# EasyEDA schematic SCH_LinBridge_3.0_2026-08-19_sanitized.json
TITLE: LinBridge; REV: 1.0; Date: 2024-12-13; Sheet: 1/1; Drawn By: LinBridge project; Company: LinBridge
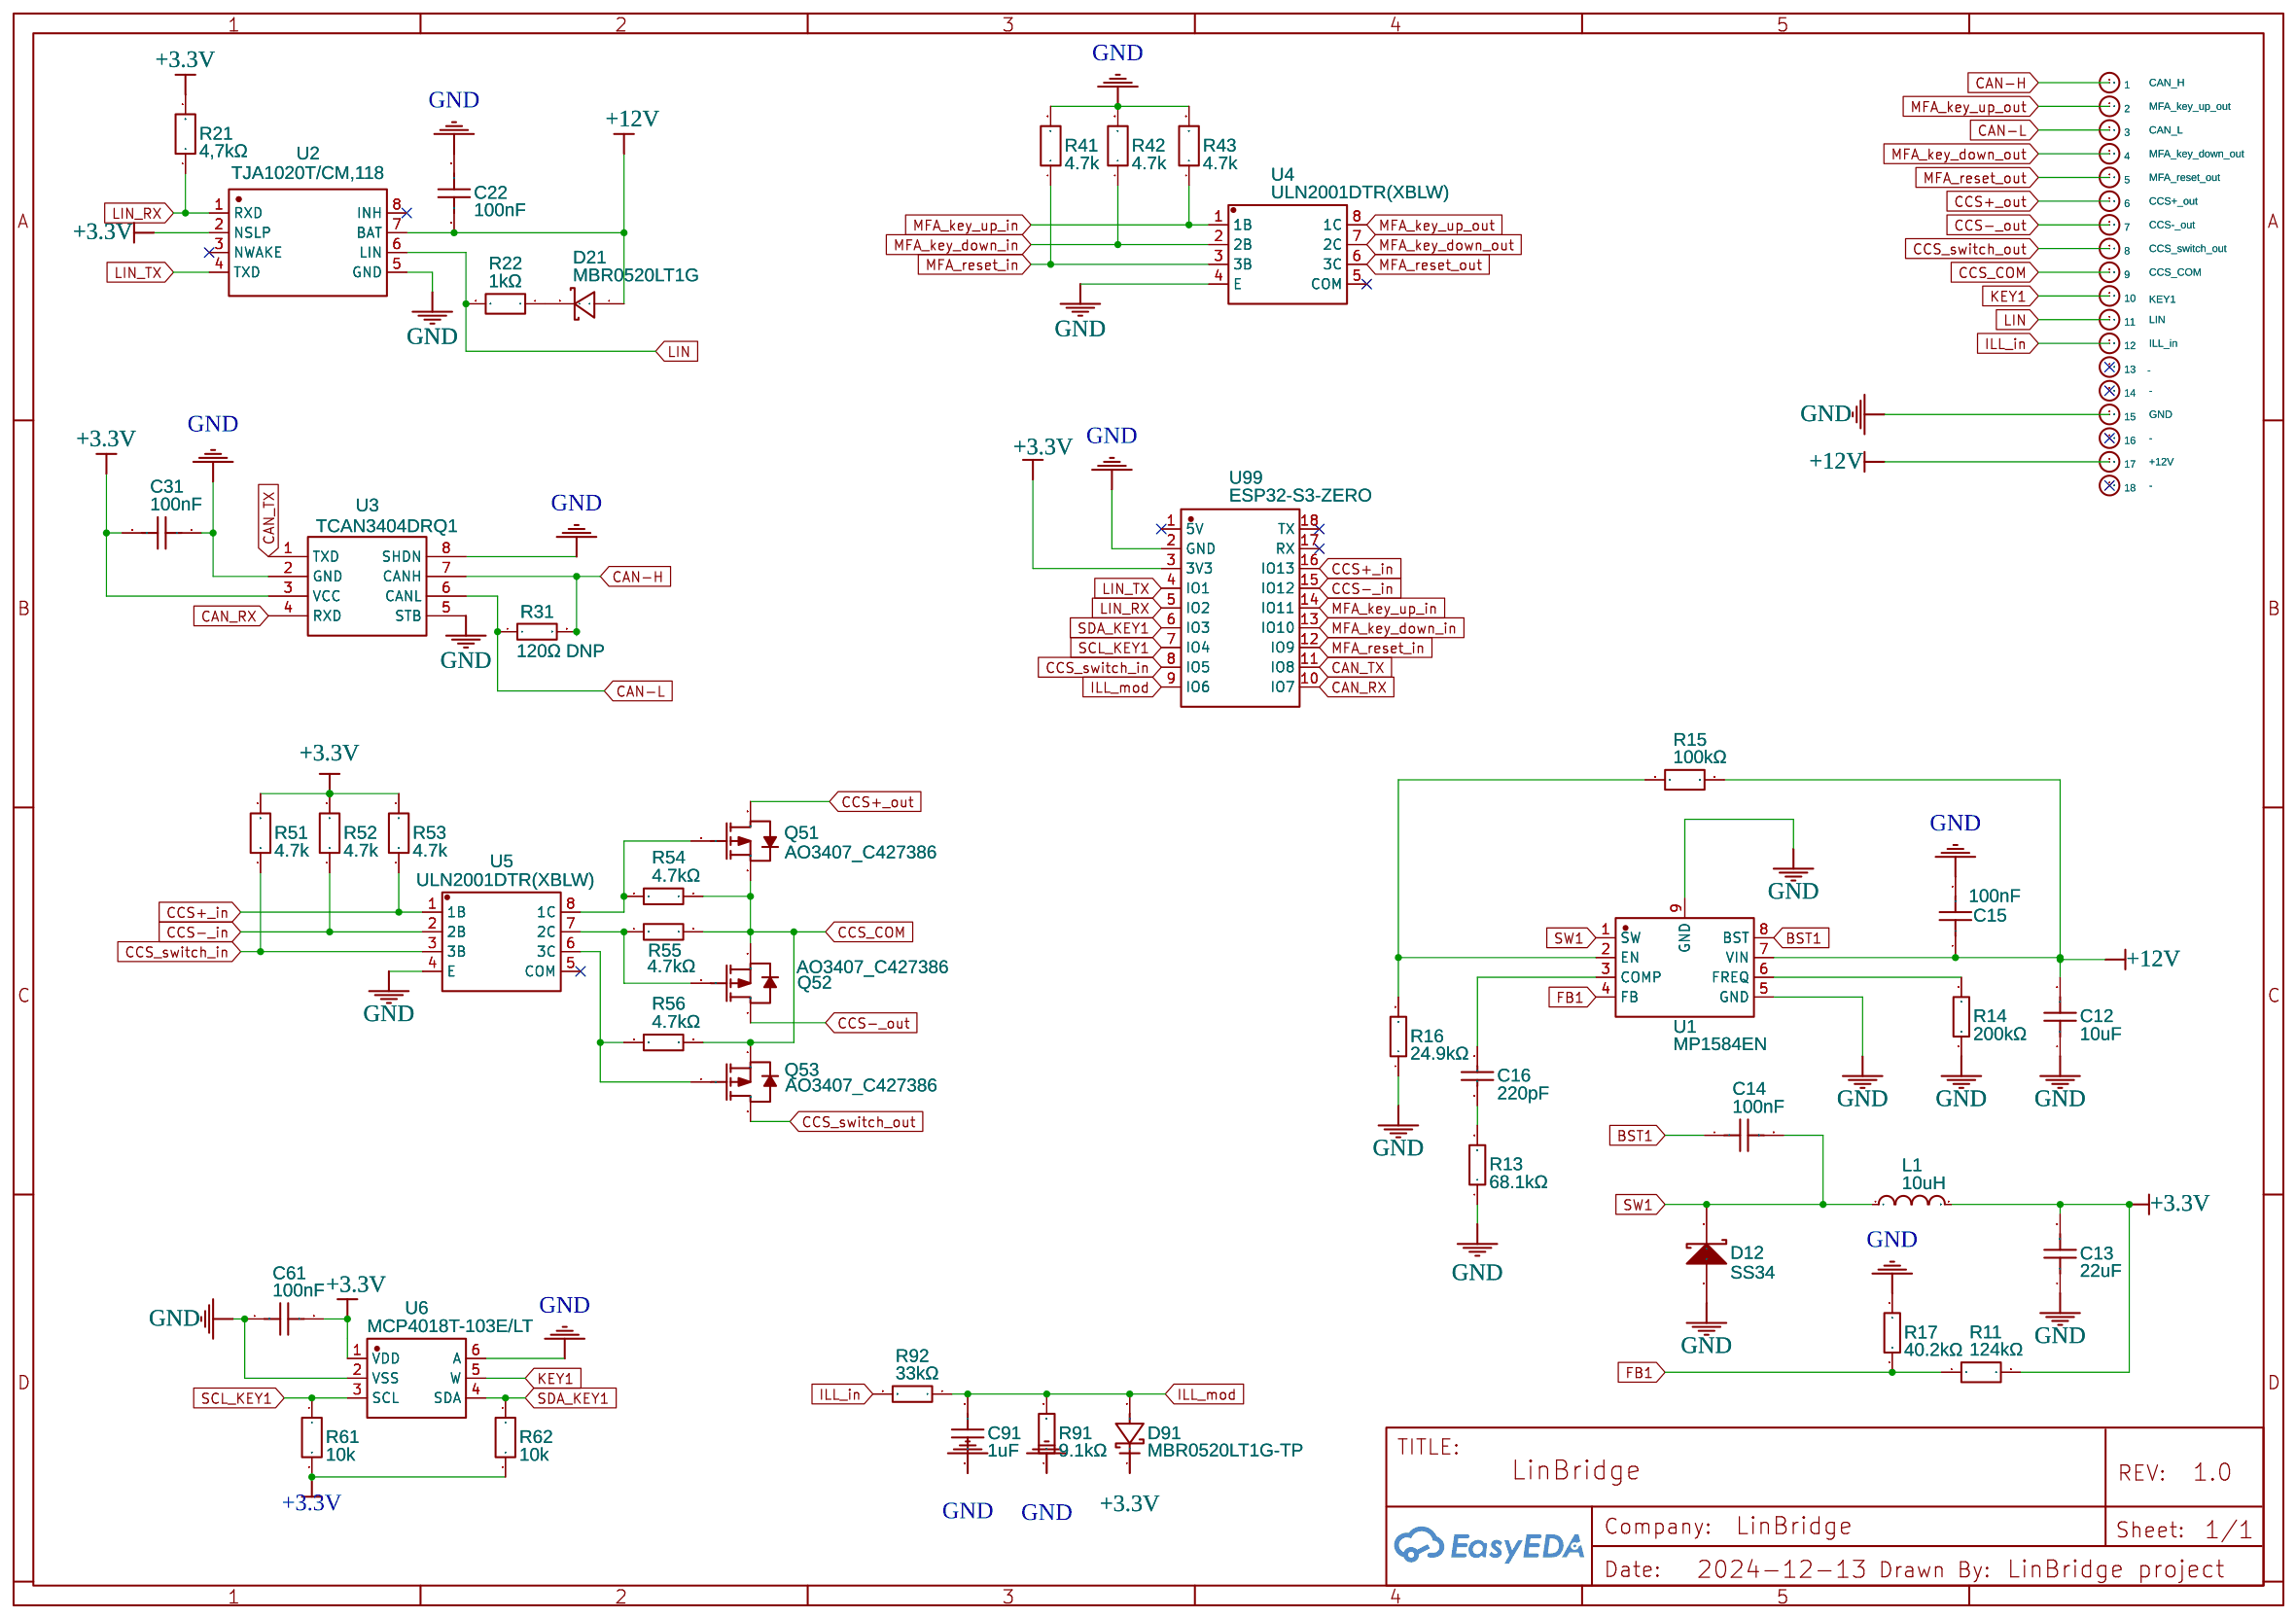
[diagram p0: schematic sheet]

## Parts
1  CAN_H  [THROUGH-HOLE-1MM]
2  MFA_key_up_out  [THROUGH-HOLE-1MM]
3  CAN_L  [THROUGH-HOLE-1MM]
4  MFA_key_down_out  [THROUGH-HOLE-1MM]
5  MFA_reset_out  [THROUGH-HOLE-1MM]
6  CCS+_out  [THROUGH-HOLE-1MM]
7  CCS-_out  [THROUGH-HOLE-1MM]
8  CCS_switch_out  [THROUGH-HOLE-1MM]
9  CCS_COM  [THROUGH-HOLE-1MM]
10  KEY1  [THROUGH-HOLE-1MM]
11  LIN  [THROUGH-HOLE-1MM]
12  ILL_in  [THROUGH-HOLE-1MM]
13  -  [THROUGH-HOLE-1MM]
14  -  [THROUGH-HOLE-1MM]
15  GND  [THROUGH-HOLE-1MM]
16  -  [THROUGH-HOLE-1MM]
17  +12V  [THROUGH-HOLE-1MM]
18  -  [THROUGH-HOLE-1MM]
C12  10uF  [C1206]
C13  22uF  [C0805]
C14  100nF  [C0805]
C15  100nF  [C0805]
C16  220pF  [C0805]
C22  100nF  [C0805]
C31  100nF  [C0805]
C61  100nF  [C0805]
C91  1uF  [C0805]
D12  SS34  [SMA(DO-214AC)]
D21  MBR0520LT1G  [MBR0520LT1G]
D91  MBR0520LT1G-TP  [SOD-123_L2.7-W1.6-LS3.6-RD]
L1  10uH  [IND-SMD_L4.0-W4.0_LQH44PN2R2MP0L]
Q51  AO3407_C427386  [SOT-23-3_L2.9-W1.3-P1.90-LS2.4-BR]
Q52  AO3407_C427386  [SOT-23-3_L2.9-W1.3-P1.90-LS2.4-BR]
Q53  AO3407_C427386  [SOT-23-3_L2.9-W1.3-P1.90-LS2.4-BR]
R11  124kΩ  [R0805]
R13  68.1kΩ  [R0805]
R14  200kΩ  [R0805]
R15  100kΩ  [R0805]
R16  24.9kΩ  [R0805]
R17  40.2kΩ  [R0805]
R21  4,7kΩ  [R0805]
R22  1kΩ  [R0805]
R31  120Ω DNP  [R0805]
R41  4.7k  [R0805]
R42  4.7k  [R0805]
R43  4.7k  [R0805]
R51  4.7k  [R0805]
R52  4.7k  [R0805]
R53  4.7k  [R0805]
R54  4.7kΩ  [R0805]
R55  4.7kΩ  [R0805]
R56  4.7kΩ  [R0805]
R61  10k  [R0805]
R62  10k  [R0805]
R91  9.1kΩ  [R0805]
R92  33kΩ  [R0805]
U1  MP1584EN  [SOIC-8_L4.9-W3.9-P1.27-LS6.0-BL-EP3.3]
U2  TJA1020T/CM,118  [SOIC-8_L4.9-W3.9-P1.27-LS6.0-BL]
U3  TCAN3404DRQ1  [SOIC-8_L5.0-W4.0-P1.27-LS6.0-BL]
U4  ULN2001DTR(XBLW)  [SOP-8_L5.0-W4.0-P1.27-LS6.0-BL]
U5  ULN2001DTR(XBLW)  [SOP-8_L5.0-W4.0-P1.27-LS6.0-BL]
U6  MCP4018T-103E/LT  [SC-70-6_L2.0-W1.3-P0.65-LS2.1-BL]
U99  ESP32-S3-ZERO  [COMM-SMD_18P-P2.54-L23.5-W18.0-TL]

## Library data of the parts
1-18 = Through_Hole_1mm: Supplier Part: undefined; Contributor: P-Thomsen
C12 = TCC1206X5R106K500HT: Supplier: LCSC; Contributor: lcsc; JLCPCB Part Class: Extended Part
C13 = TCC1206X7R226M100HT: Supplier: LCSC; JLCPCB Part Class: Extended Part; Contributor: lcsc
C14 = TCC0603X7R104K250CT: Supplier: LCSC; JLCPCB Part Class: Extended Part; Contributor: lcsc
C15 C22 = C0805C104K5RAC7411: Contributor: LCSC; Supplier: LCSC; Supplier Part: C141128; Manufacturer: KEMET(基美); JLCPCB Part Class: Extended Part
C16 = CC0603JRNPO9BN221: Supplier: LCSC; JLCPCB Part Class: Extended Part
C31 = C0805-100NF: Contributor: LCSC; Supplier: LCSC; Supplier Part: C502153; Manufacturer: IHHEC(禾伸堂); Manufacturer Part: C0805X104K050T; JLCPCB Part Class: Extended Part
C61 = CC0805KRX7R7BB104: Contributor: LCSC; Supplier: LCSC; Supplier Part: C519980; Manufacturer: YAGEO(国巨); JLCPCB Part Class: Extended Part
C91 = C0805C105K5RACTU: Supplier: LCSC; Supplier Part: C3018567; Manufacturer: KEMET(基美); Contributor: lcsc; JLCPCB Part Class: Extended Part
D12 = -: Supplier: LCSC; Manufacturer: ON; Supplier Part: C23848
D21 = MBR0520LT1G: Contributor: pb158
D91 = MBR0520LT1G-TP: Supplier: LCSC; Supplier Part: C53477690; Manufacturer: TECH PUBLIC(台舟); JLCPCB Part Class: Extended Part; Contributor: lcsc
L1 = SMNR4020-10UH: Supplier: LCSC; Manufacturer: SXN(顺翔诺); Supplier Part: C135263; JLCPCB Part Class: Extended Part
Q51-Q53 = AO3407_C427386: Contributor: LCSC; Supplier: LCSC; Supplier Part: C427386; Manufacturer: MDD(辰达半导体); Manufacturer Part: MDD3407; JLCPCB Part Class: Extended Part
R11 = TD03G1243BT: Contributor: LCSC; Supplier: LCSC; JLCPCB Part Class: Extended Part
R13 = 0402WGF6812TCE: Supplier: LCSC; JLCPCB Part Class: Extended Part
R14 = CR1206F42003G: Supplier: LCSC; JLCPCB Part Class: Extended Part
R15 = 1210W2F1003T5E: Contributor: LCSC; Supplier: LCSC; JLCPCB Part Class: Extended Part
R16 = 0402WGF2492TCE: Supplier: LCSC; JLCPCB Part Class: Extended Part
R17 = RTT034022FTP: Supplier: LCSC; JLCPCB Part Class: Extended Part
R21 R22 = APC0805B1K00N: Supplier: LCSC; Supplier Part: C5553672; Manufacturer: Ohmite; Contributor: lcsc; JLCPCB Part Class: Extended Part
R31 = 120Ω 0,1%: Power: 1/4W; Tolerance: ±1%; Supplier Part: C83627; Supplier: LCSC; Manufacturer: UniOhm; Manufacturer Part: TC052B1200T5E; LCSC Assembly: YES
R41-R43 R51-R53 = R_0603_EU: Supplier Part: C60816; Supplier: LCSC; Contributor: LCEDA_Lib; Manufacturer Part: RC0805FR-074K7L; Manufacturer: YAGEO(国巨)
R54-R56 = RMC08054.7K1%N: Contributor: LCSC; Supplier: LCSC; Supplier Part: C269746; Manufacturer: Tyohm(幸亚电阻); JLCPCB Part Class: Extended Part
R61 R62 = R_0603_EU: Supplier Part: C3016734; Supplier: LCSC; Contributor: LCEDA_Lib; Manufacturer Part: SCR0805F10K; Manufacturer: VO(翔胜)
R91 = RMC08059.1K1%N: Contributor: LCSC; Supplier: LCSC; Supplier Part: C325830; Manufacturer: Tyohm(幸亚电阻); JLCPCB Part Class: Extended Part
R92 = AECR0805F27K0K9: Contributor: LCSC; Supplier: LCSC; Supplier Part: C352234; Manufacturer: RESI(开步睿思); JLCPCB Part Class: Extended Part
U1 = MP1584EN: Contributor: LCSC; Supplier: LCSC; Supplier Part: C454188; Manufacturer: null; JLCPCB Part Class: Extended Part
U2 = TJA1020T/CM,118: Supplier: LCSC; Manufacturer: NXP(恩智浦); Supplier Part: C6950; JLCPCB Part Class: Extended Part
U3 = TJA1050T/CM,118: Supplier: LCSC; Manufacturer: NXP; LCSC Assembly: Yes; image: //image.lceda.cn/szlcsc/C6952.jpg; Supplier Part: C6952; SMT Type: Basic
U4 U5 = ULN2001DTR(XBLW): Supplier: LCSC; Supplier Part: C18723567; Manufacturer: XBLW(芯伯乐); JLCPCB Part Class: Extended Part; Contributor: lcsc
U6 = MCP4018T-104E/LT: Contributor: LCSC; Supplier: LCSC; Supplier Part: C512188; Manufacturer: MICROCHIP(美国微芯); JLCPCB Part Class: Extended Part
U99 = ESP32-S3-ZERO: Supplier: LCSC; Supplier Part: C9900152785; Manufacturer: null; Manufacturer Part: ESP32-S3-Zero; Contributor: lcsc

## Nets
+3.3V: C13.2 C31.2 C61.2 D91.1(K) L1.2 R11.2 R21.2 R51.2 R52.2 R53.2 R61.2 R62.2 U2.2(NSLP) U3.3(VCC) U6.1(VDD) U99.3(3V3)
+12V: 17.1 C12.2 C15.1 C22.1 D21.1(A) R15.2 U1.7(VIN) U2.7(BAT)
GND: 15.1 C12.1 C13.1 C15.2 C22.2 C31.1 C61.1 C91.2 D12.1(A) R13.1 R14.1 R16.1 R17.2 R41.2 R42.2 R43.2 R91.1 U1.5(GND) U1.9(GND) U2.5(GND) U3.2(GND) U3.5(STB) U3.8(SHDN) U4.4(E) U5.4(E) U6.2(VSS) U6.6(A) U99.2(GND)
BST1: C14.1 U1.8(BST)
CAN-H: 1.1 R31.2 U3.7(CANH)
CAN-L: 3.1 R31.1 U3.6(CANL)
CAN_RX: U3.4(RXD) U99.10(IO7)
CAN_TX: U3.1(TXD) U99.11(IO8)
CCS+_in: R53.1 U5.1(1B) U99.16(IO13)
CCS+_out: 6.1 Q51.3(D)
CCS-_in: R52.1 U5.2(2B) U99.15(IO12)
CCS-_out: 7.1 Q52.3(D)
CCS_COM: 9.1 Q51.2(S) Q52.2(S) Q53.2(S) R54.2 R55.2 R56.2
CCS_switch_in: R51.1 U5.3(3B) U99.8(IO5)
CCS_switch_out: 8.1 Q53.3(D)
FB1: R11.1 R17.1 U1.4(FB)
ILL_in: 12.1 R92.2
ILL_mod: C91.1 D91.2(A) R91.2 R92.1 U99.9(IO6)
KEY1: 10.1 U6.5(W)
LIN: 11.1 R22.2 U2.6(LIN)
LIN_RX: R21.1 U2.1(RXD) U99.5(IO2)
LIN_TX: U2.4(TXD) U99.4(IO1)
MFA_key_down_in: R42.1 U4.2(2B) U99.13(IO10)
MFA_key_down_out: 4.1 U4.7(2C)
MFA_key_up_in: R43.1 U4.1(1B) U99.14(IO11)
MFA_key_up_out: 2.1 U4.8(1C)
MFA_reset_in: R41.1 U4.3(3B) U99.12(IO9)
MFA_reset_out: 5.1 U4.6(3C)
SCL_KEY1: R61.1 U6.3(SCL) U99.7(IO4)
SDA_KEY1: R62.1 U6.4(SDA) U99.6(IO3)
SW1: C14.2 D12.2(K) L1.1 U1.1(SW)
Net-(C16-1): C16.1 R13.2
Net-(C16-2): C16.2 U1.3(COMP)
Net-(D21-2): D21.2(K) R22.1
Net-(Q51-1): Q51.1(G) R54.1 U5.8(1C)
Net-(Q52-1): Q52.1(G) R55.1 U5.7(2C)
Net-(Q53-1): Q53.1(G) R56.1 U5.6(3C)
Net-(R14-2): R14.2 U1.6(FREQ)
Net-(R15-1): R15.1 R16.2 U1.2(EN)

Not connected (* = marked no-connect by the designer): 13 1*; 14 1*; 16 1*; 18 1*; U2 3(NWAKE)* 8(INH)*; U4 5(COM)*; U5 5(COM)*; U99 1(5V)* 17(RX)* 18(TX)*
